# EasyEDA Pro project ProPrj_ms5837holder_2026-05-16.epro

# Schematic Schematic1
Board Name: Board1; Create Date: 2026-03-24; Page Name: P1; Project Name: ms5837holder; Schematic Name: Schematic1; Update Date: 2026-03-24; Company: EasyEDA.com; Page Size: A4; Version: V1.0
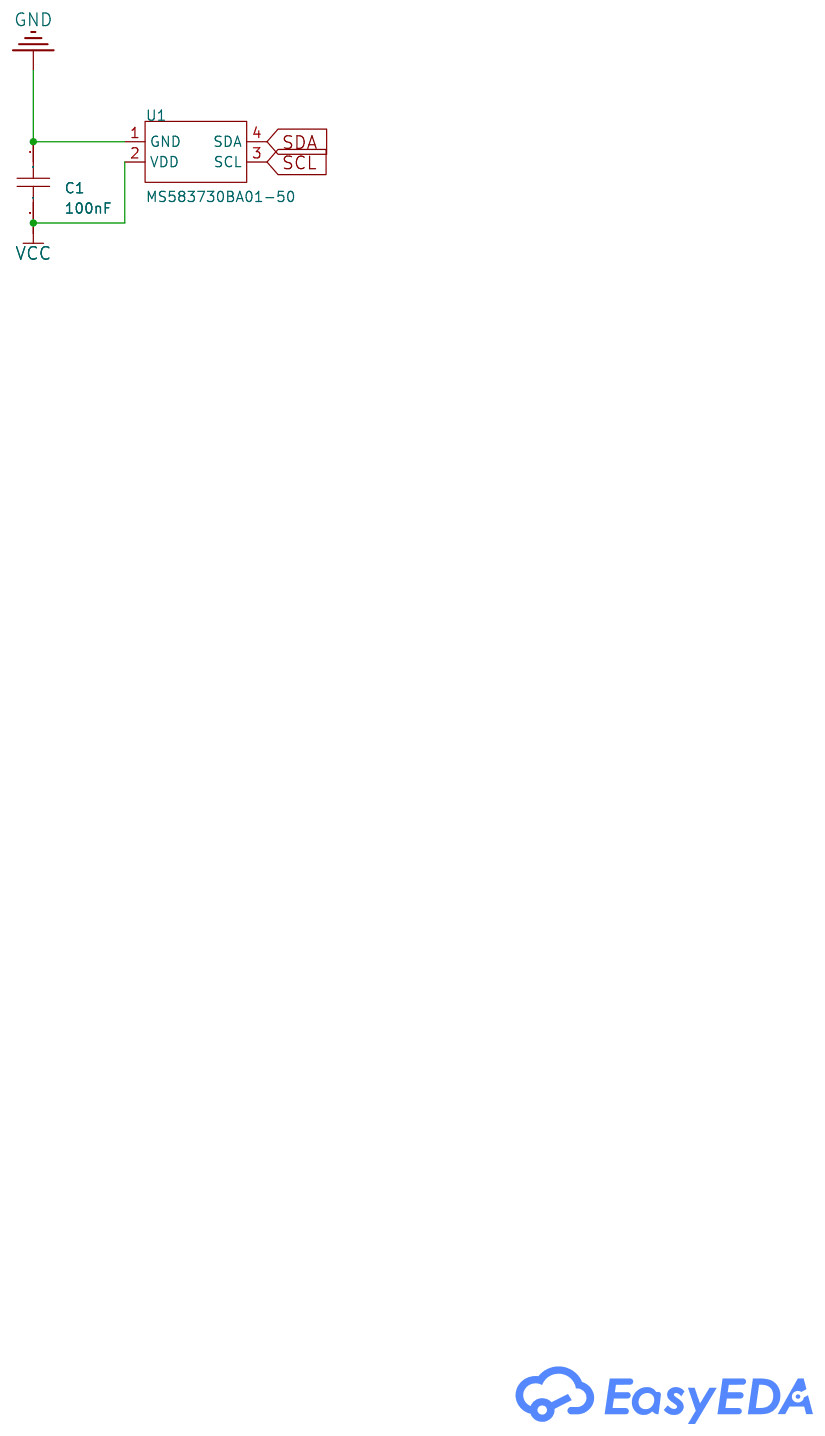
[diagram p0: schematic sheet]

## Parts
C1  100nF  [C0402]
U1  MS583730BA01-50  [SENSOR-SMD_4P-L3.3-W3.3-P2.00-BL]

## Library data of the parts
C1 = CL05B104KB54PNC: Capacitance:100nF Tolerance:±10% Tolerance:±10% Voltage Rating:50V Temperature Coefficient:X7R; LCSC Part Name: 100nF ±10% 50V; Supplier Part: C307331; Manufacturer: SAMSUNG(三星); Supplier Footprint: 0402; JLCPCB Part Class: Basic Part; Datasheet: https://item.szlcsc.com/datasheet/CL05B104KB54PNC/291005.html; Supplier: LCSC; Tolerance: ±10%; Voltage Rating: 50V; Temperature Coefficient: X7R
U1 = MS583730BA01-50: Supplier Part: C2887941; Manufacturer: TE Connectivity(泰科电子); Supplier Footprint: SMD-4P,3.3x3.3mm; JLCPCB Part Class: Extended Part; Datasheet: https://item.szlcsc.com/datasheet/MS583730BA01-50/3106171.html; Supplier: LCSC

## Nets
GND: C1.1 U1.1(GND)
VCC: C1.2 U1.2(VDD)
SCL: U1.3(SCL)
SDA: U1.4(SDA)

# Board PCB1
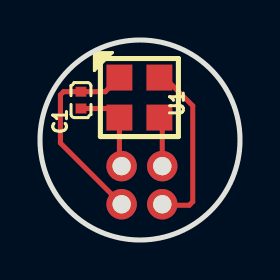
[diagram p1: board, top side]
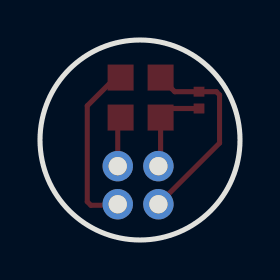
[diagram p2: board, bottom side, seen from below]

Outline 10 x 10 mm; copper layers: Top Layer, Bottom Layer. Coordinates in mm from the lower left corner of the outline.
Outline path: circle c5,5 r5
Stack: Top Layer 0.035mm / Dielectric1 1.51mm FR4 er 4.5 / Bottom Layer 0.035mm

## Design rules (mm)
template: JLCPCB Capability(Two Layers Board)
spacing copperThickness1oz (default): track to track 0.102, other pairs 0.152 to 0.3
spacing copperThickness2oz: track to track 0.203, other pairs 0.152 to 0.3
track width copperThickness1oz (default): min 0.127, default 0.254, max 2.54
track width copperThickness2oz: min 0.203, default 0.254, max 2.54
differential pair differentialPair (default): width min 0.127, default 0.254, max 2.54; gap min 0.152, default 0.152
via viaSize (default): diameter min 0.5, default 0.61, max 10; hole min 0.3, default 0.305, max 6.3

## Placement (name value [footprint] x y rotation side)
C1  100nF  [C0402]  2.05 7 270 top
NOREF  -  [Pad_e5]  6.11 3.69 0 top
NOREF#2  -  [Pad_e7]  6.11 1.79 0 top
NOREF#3  -  [Pad_e6]  4.08 3.69 0 top
NOREF#4  -  [Pad_e4]  4.08 1.79 0 top
U1  MS583730BA01-50  [SENSOR-SMD_4P-L3.3-W3.3-P2.00-BL]  4.97 7.12 270 top

## Footprints (pads in the part's own frame, mm; a bottom-side part is the same pattern mirrored in y, then rotated)
C0402
  rect 0.5x0.54 smd: 1(-0.42,0) 2(0.42,0)
Pad_e4
  round 1.524 hole 0.914: 1(0,0)
Pad_e5
  round 1.524 hole 0.914: 2(0,0)
Pad_e6
  round 1.524 hole 0.914: 3(0,0)
Pad_e7
  round 1.524 hole 0.914: 4(0,0)
SENSOR-SMD_4P-L3.3-W3.3-P2.00-BL
  rect 1.3x1.3 smd: 1(-1,-1) 2(1,-1) 3(1,1) 4(-1,1)

## Nets
GND: C1.1 NOREF#4.1 U1.1
VCC: C1.2 NOREF#3.3 U1.2
SCL: NOREF.2 U1.3
SDA: NOREF#2.4 U1.4

## Routing (per net, layer and track width the routed paths; a pad name or vN(x,y) marks a point on that pad's centre or on a via; arc(x,y) is an arc through that point)
GND: length 10
  Top Layer w0.254: U1.1 3.26,7.42 C1.1 1.18,7.42 1.02,7.26 1.02,4.85 NOREF#4.1
VCC: length 4.6
  Top Layer w0.254: C1.2 3.52,6.58 U1.2 3.97,3.8 NOREF#3.3
SCL: length 2.7
  Top Layer w0.254: NOREF.2 6.11,6.23 5.97,6.38
SDA: length 8.8
  Top Layer w0.254: 6.11,1.66 6.19,1.74 7.46,1.74 7.64,1.92 7.64,6.71 5.97,8.38
